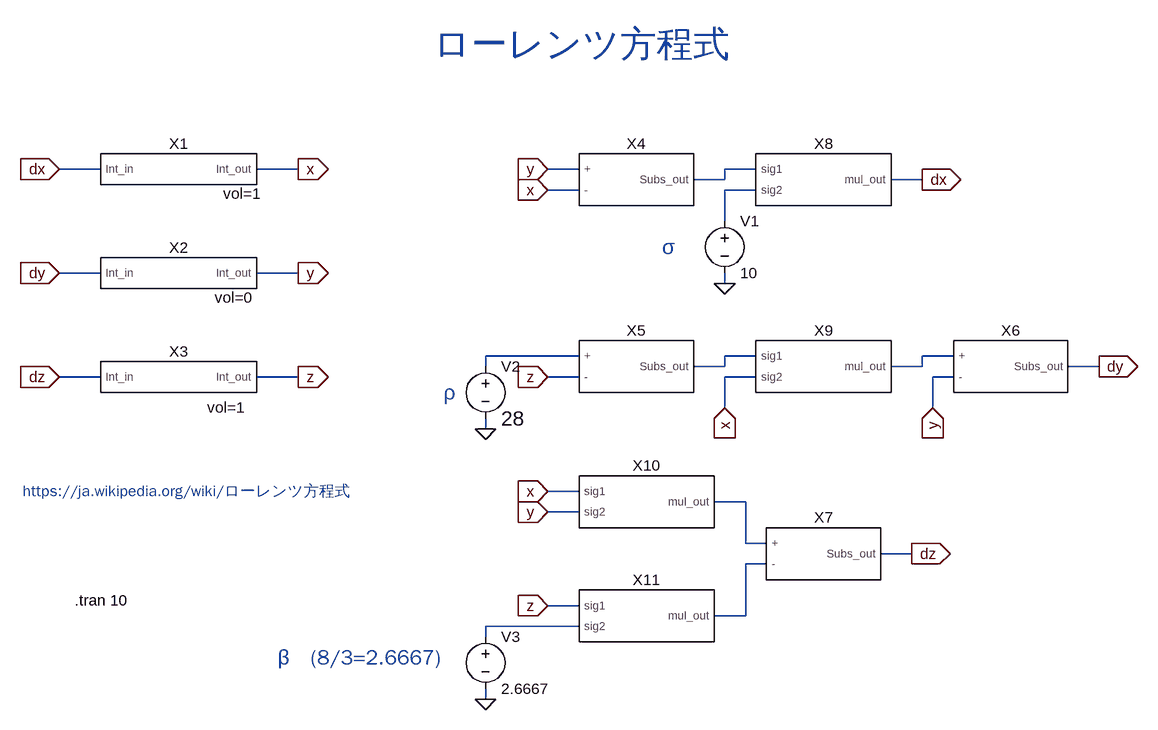
[diagram p0: schematic lorenz28new.asc]
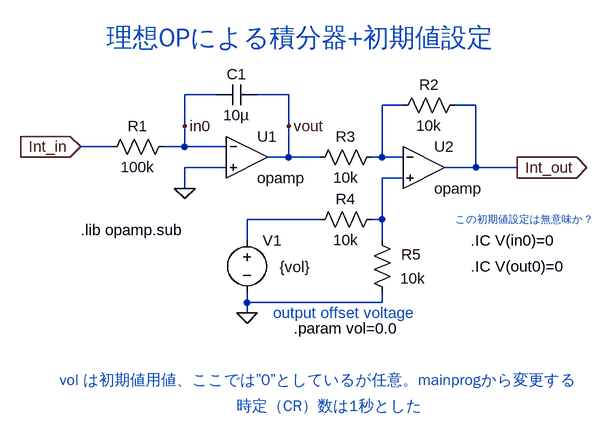
[diagram p1: sub-circuit int_lv2.asc]
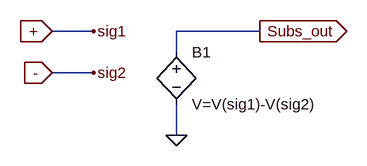
[diagram p2: sub-circuit sub_lv1.asc]
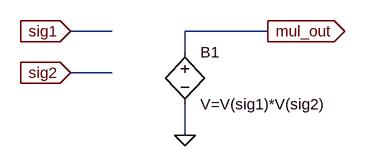
[diagram p3: sub-circuit mul_lv1.asc]
lorenz28new.asc, the LTspice schematic file:
Version 4.1
SHEET 1 920 680
WIRE -704 -272 -768 -272
WIRE -400 -272 -464 -272
WIRE 32 -272 -16 -272
WIRE 304 -272 256 -272
WIRE 256 -256 256 -272
WIRE 256 -256 208 -256
WIRE 560 -256 512 -256
WIRE 32 -240 -16 -240
WIRE 304 -240 256 -240
WIRE 256 -192 256 -240
WIRE -704 -112 -768 -112
WIRE -400 -112 -464 -112
WIRE 256 -96 256 -112
WIRE 32 16 -112 16
WIRE 304 16 256 16
WIRE 608 16 560 16
WIRE -112 32 -112 16
WIRE 256 32 256 16
WIRE 256 32 208 32
WIRE 560 32 560 16
WIRE 560 32 512 32
WIRE 832 32 784 32
WIRE -704 48 -768 48
WIRE -400 48 -464 48
WIRE 32 48 -16 48
WIRE 304 48 256 48
WIRE 608 48 576 48
WIRE 256 96 256 48
WIRE 576 96 576 48
WIRE -112 128 -112 112
WIRE 32 224 -16 224
WIRE 288 240 240 240
WIRE 32 256 -16 256
WIRE 288 304 288 240
WIRE 320 304 288 304
WIRE 544 320 496 320
WIRE 320 336 288 336
WIRE 32 400 -16 400
WIRE 288 416 288 336
WIRE 288 416 240 416
WIRE 32 432 -112 432
WIRE -112 448 -112 432
WIRE -112 544 -112 528
FLAG -768 -272 dx
IOPIN -768 -272 In
FLAG -768 -112 dy
IOPIN -768 -112 In
FLAG -768 48 dz
IOPIN -768 48 In
FLAG -400 -272 x
IOPIN -400 -272 Out
FLAG -400 -112 y
IOPIN -400 -112 Out
FLAG -400 48 z
IOPIN -400 48 Out
FLAG -16 -240 x
IOPIN -16 -240 In
FLAG -16 -272 y
IOPIN -16 -272 In
FLAG 256 -96 0
FLAG 560 -256 dx
IOPIN 560 -256 Out
FLAG -112 128 0
FLAG -16 48 z
IOPIN -16 48 In
FLAG 256 96 x
IOPIN 256 96 In
FLAG 576 96 y
IOPIN 576 96 In
FLAG 832 32 dy
IOPIN 832 32 Out
FLAG -16 224 x
IOPIN -16 224 In
FLAG -16 256 y
IOPIN -16 256 In
FLAG -16 400 z
IOPIN -16 400 In
FLAG -112 544 0
FLAG 544 320 dz
IOPIN 544 320 Out
SYMBOL voltage 256 -208 R0
WINDOW 123 0 0 Left 0
WINDOW 39 0 0 Left 0
SYMATTR InstName V1
SYMATTR Value 10
SYMBOL voltage -112 16 R0
WINDOW 123 0 0 Left 0
WINDOW 39 0 0 Left 0
WINDOW 3 24 96 Left 3
SYMATTR Value 28
SYMATTR InstName V2
SYMBOL voltage -112 432 R0
WINDOW 123 0 0 Left 0
WINDOW 39 0 0 Left 0
SYMATTR InstName V3
SYMATTR Value 2.6667
SYMBOL INT_lv2 -592 -272 R0
WINDOW 39 106 53 Bottom 2
SYMATTR SpiceLine vol=1
SYMATTR InstName X1
SYMBOL INT_lv2 -592 -112 R0
WINDOW 39 93 53 Bottom 2
SYMATTR SpiceLine vol=0
SYMATTR InstName X2
SYMBOL sub_lv1 112 -256 R0
SYMATTR InstName X4
SYMBOL sub_lv1 112 32 R0
SYMATTR InstName X5
SYMBOL sub_lv1 688 32 R0
SYMATTR InstName X6
SYMBOL sub_lv1 400 320 R0
SYMATTR InstName X7
SYMBOL mul_lv1 400 -256 R0
SYMATTR InstName X8
SYMBOL mul_lv1 400 32 R0
SYMATTR InstName X9
SYMBOL mul_lv1 128 240 R0
SYMATTR InstName X10
SYMBOL mul_lv1 128 416 R0
SYMATTR InstName X11
SYMBOL INT_lv2 -592 48 R0
WINDOW 39 52 47 Left 2
SYMATTR SpiceLine vol=1
SYMATTR InstName X3
TEXT -744 392 Left 2 !.tran 10
TEXT 160 -152 Left 3 ;σ
TEXT -176 72 Left 3 ;ρ
TEXT -432 480 Left 3 ;β　(8/3=2.6667)
TEXT -192 -464 Left 5 ;ローレンツ方程式
TEXT -824 224 Left 2 ;https://ja.wikipedia.org/wiki/ローレンツ方程式

int_lv2.asc, the sub-circuit schematic file:
Version 4.1
SHEET 1 880 680
WIRE 16 -128 -32 -128
WIRE 128 -128 80 -128
WIRE 304 -112 272 -112
WIRE 416 -112 384 -112
WIRE -32 -80 -32 -128
WIRE 128 -80 128 -128
WIRE -144 -48 -192 -48
WIRE -32 -48 -32 -80
WIRE -32 -48 -64 -48
WIRE 32 -48 -32 -48
WIRE 128 -32 128 -80
WIRE 128 -32 96 -32
WIRE 176 -32 128 -32
WIRE 272 -32 272 -112
WIRE 272 -32 256 -32
WIRE 304 -32 272 -32
WIRE 32 -16 -32 -16
WIRE 416 -16 416 -112
WIRE 416 -16 368 -16
WIRE 480 -16 416 -16
WIRE 304 0 272 0
WIRE -32 16 -32 -16
WIRE 176 64 64 64
WIRE 272 64 272 0
WIRE 272 64 256 64
WIRE 64 96 64 64
WIRE 272 96 272 64
WIRE 64 192 64 176
WIRE 272 192 272 176
WIRE 272 192 64 192
WIRE 64 208 64 192
FLAG -192 -48 Int_in
IOPIN -192 -48 In
FLAG 128 -80 vout
FLAG 480 -16 Int_out
IOPIN 480 -16 Out
FLAG -32 -80 in0
FLAG -32 16 0
FLAG 64 208 0
SYMBOL cap 16 -112 R270
WINDOW 0 32 32 VTop 2
WINDOW 3 0 32 VBottom 2
SYMATTR InstName C1
SYMATTR Value 10µ
SYMBOL res -48 -64 R90
WINDOW 0 0 56 VBottom 2
WINDOW 3 32 56 VTop 2
SYMATTR InstName R1
SYMATTR Value 100k
SYMBOL OpAmps\\opamp 64 -96 R0
SYMATTR InstName U1
SYMATTR SpiceLine Aol=10meg
SYMATTR SpiceLine2 GBW=1g
SYMBOL OpAmps\\opamp 336 -80 R0
SYMATTR InstName U2
SYMATTR SpiceLine Aol=10meg
SYMATTR SpiceLine2 GBW=1g
SYMBOL res 400 -128 R90
WINDOW 0 0 56 VBottom 2
WINDOW 3 32 56 VTop 2
SYMATTR InstName R2
SYMATTR Value 10k
SYMBOL res 272 -48 R90
WINDOW 0 0 56 VBottom 2
WINDOW 3 32 56 VTop 2
SYMATTR InstName R3
SYMATTR Value 10k
SYMBOL res 272 48 R90
WINDOW 0 0 56 VBottom 2
WINDOW 3 32 56 VTop 2
SYMATTR InstName R4
SYMATTR Value 10k
SYMBOL res 288 192 R180
WINDOW 0 -44 74 Left 2
WINDOW 3 -51 37 Left 2
SYMATTR InstName R5
SYMATTR Value 10k
SYMBOL voltage 64 80 R0
WINDOW 123 0 0 Left 0
WINDOW 39 0 0 Left 0
WINDOW 3 50 57 Left 2
SYMATTR Value {vol}
SYMATTR InstName V1
TEXT -192 80 Left 2 !.lib opamp.sub
TEXT 136 232 Left 2 !.param vol=0.0
TEXT -224 312 Left 2 ;vol は初期値用値、ここでは”0”としているが任意。mainprogから変更する
TEXT 48 352 Left 2 ;時定（CR）数は1秒とした
TEXT 104 208 Left 2 ;output offset voltage
TEXT 408 96 Left 2 !.IC V(in0)=0
TEXT 408 136 Left 2 !.IC V(out0)=0
TEXT 384 64 Left 1 ;この初期値設定は無意味か？
TEXT -152 -216 Left 4 ;理想OPによる積分器+初期値設定

sub_lv1.asc, the sub-circuit schematic file:
Version 4.1
SHEET 1 880 680
WIRE 32 80 -32 80
WIRE 288 80 160 80
WIRE 160 112 160 80
WIRE 32 144 -32 144
WIRE 160 240 160 192
FLAG 160 240 0
FLAG 32 80 sig1
FLAG 32 144 sig2
FLAG 288 80 Subs_out
IOPIN 288 80 Out
FLAG -32 80 +
IOPIN -32 80 In
FLAG -32 144 -
IOPIN -32 144 In
SYMBOL bv 160 96 R0
SYMATTR InstName B1
SYMATTR Value V=V(sig1)-V(sig2)

mul_lv1.asc, the sub-circuit schematic file:
Version 4.1
SHEET 1 880 680
WIRE 0 64 -64 64
WIRE 240 64 112 64
WIRE 112 96 112 64
WIRE 0 128 -64 128
WIRE 112 224 112 176
FLAG 112 224 0
FLAG -64 64 sig1
IOPIN -64 64 In
FLAG 240 64 mul_out
IOPIN 240 64 Out
FLAG -64 128 sig2
IOPIN -64 128 In
SYMBOL bv 112 80 R0
SYMATTR InstName B1
SYMATTR Value V=V(sig1)*V(sig2)

The netlist it stands for:
* lorenz28new.asc
V1 N002 0 10
V2 N003 0 28
V3 N008 0 2.6667
X§X1 dx x int_lv2 params: vol=1
X§X2 dy y int_lv2 params: vol=0
X§X4 y x N001 sub_lv1
X§X5 N003 z N004 sub_lv1
X§X6 N005 y dy sub_lv1
X§X7 N006 N007 dz sub_lv1
X§X8 N001 N002 dx mul_lv1
X§X9 N004 x N005 mul_lv1
X§X10 x y N006 mul_lv1
X§X11 z N008 N007 mul_lv1
X§X3 dz z int_lv2 params: vol=1

* block symbol definitions
.subckt int_lv2 Int_in Int_out
C1 in0 vout 10µ
R1 in0 Int_in 100k
X§U1 in0 0 vout opamp Aol=10meg GBW=1g  ; pins invin noninvin out
X§U2 N001 N002 Int_out opamp Aol=10meg GBW=1g  ; pins invin noninvin out
R2 Int_out N001 10k
R3 N001 vout 10k
R4 N002 N003 10k
R5 0 N002 10k
V1 N003 0 {vol}
.lib opamp.sub
.param vol=0.0
* vol は初期値用値、ここでは”0”としているが任意。mainprogから変更する
* 時定（CR）数は1秒とした
* output offset voltage
.IC V(in0)=0
.IC V(out0)=0
* この初期値設定は無意味か？
* 理想OPによる積分器+初期値設定
.ends int_lv2

.subckt sub_lv1 + - Subs_out
B1 Subs_out 0 V=V(sig1)-V(sig2)
.ends sub_lv1

.subckt mul_lv1 sig1 sig2 mul_out
B1 mul_out 0 V=V(sig1)*V(sig2)
.ends mul_lv1

.tran 10
* σ
* ρ
* β　(8/3=2.6667)
* ローレンツ方程式
* https://ja.wikipedia.org/wiki/ローレンツ方程式
.backanno
.end